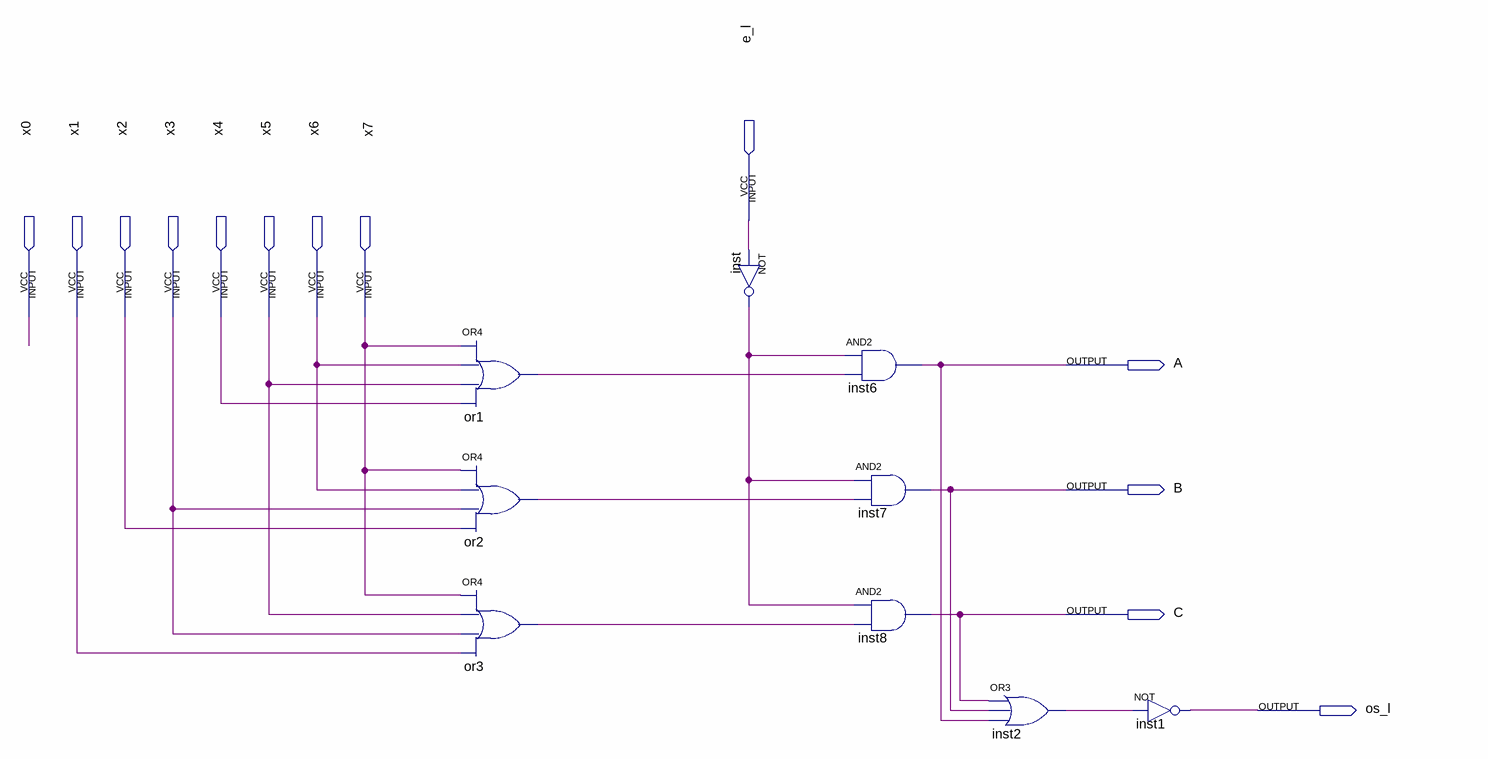
[diagram p0: schematic sheet]
// Quartus schematic PEnc8_3.bdf as structural Verilog: 9 symbols, 13 pins
module PEnc8_3 (
  input  e_l,
  input  x0,
  input  x1,
  input  x2,
  input  x3,
  input  x4,
  input  x5,
  input  x6,
  input  x7,
  output A,
  output B,
  output C,
  output os_l
);

  wire inst2_out, inst_out, or1_out, or2_out, or3_out;

  or or1 (or1_out, x7, x6, x5, x4);
  or or2 (or2_out, x7, x6, x3, x2);
  or or3 (or3_out, x7, x5, x3, x1);
  not inst (inst_out, e_l);
  and inst6 (A, inst_out, or1_out);
  and inst7 (B, inst_out, or2_out);
  and inst8 (C, inst_out, or3_out);
  or inst2 (inst2_out, C, B, A);
  not inst1 (os_l, inst2_out);
endmodule
